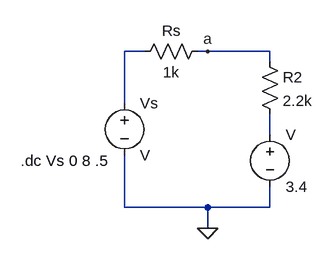
[diagram p0: schematic Circuit2.asc]
Circuit2.asc, the LTspice schematic file:
Version 4
SHEET 1 880 680
WIRE 32 112 0 112
WIRE 128 112 112 112
WIRE 224 112 128 112
WIRE 224 128 224 112
WIRE 0 192 0 112
WIRE 224 240 224 208
WIRE 0 352 0 272
WIRE 128 352 0 352
WIRE 224 352 224 320
WIRE 224 352 128 352
WIRE 128 384 128 352
FLAG 128 384 0
FLAG 128 112 a
SYMBOL res 16 128 R270
WINDOW 0 32 56 VTop 2
WINDOW 3 0 56 VBottom 2
SYMATTR InstName Rs
SYMATTR Value 1k
SYMBOL res 208 112 R0
SYMATTR InstName R2
SYMATTR Value 2.2k
SYMBOL voltage 224 224 R0
SYMATTR InstName V
SYMATTR Value 3.4
SYMBOL voltage 0 176 R0
SYMATTR InstName Vs
TEXT -160 280 Left 2 !.dc Vs 0 8 .5

The netlist it stands for:
* Circuit2.asc
Rs N001 a 1k
R2 a N002 2.2k
V N002 0 3.4
Vs N001 0 V
.dc Vs 0 8 .5
.backanno
.end